# EAGLE design HSBASIC (EAGLE 9.5.0)
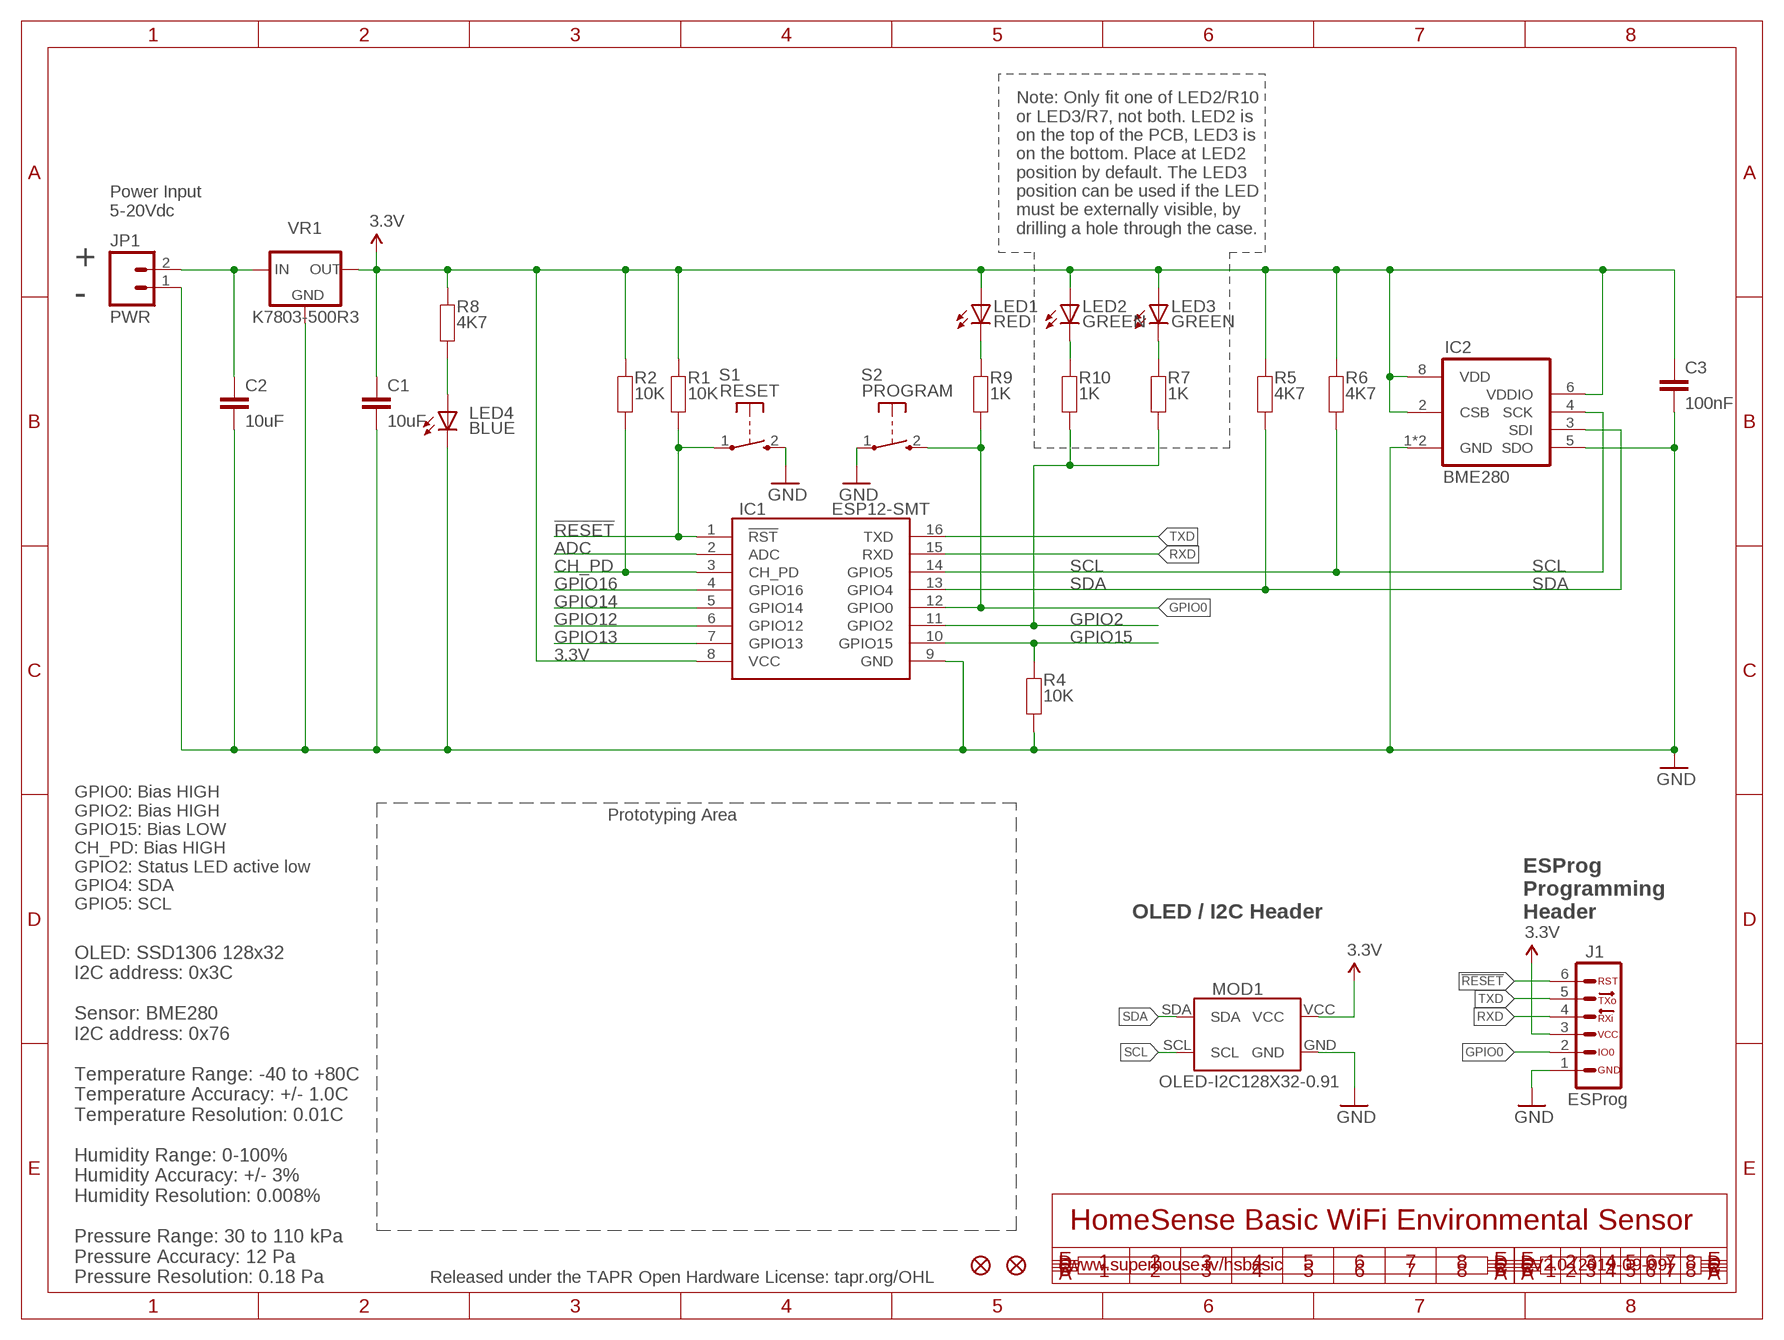
[diagram p0: schematic, sheet 1]

## Parts
C1  10uF  CAP0805  [C0805]
C2  10uF  CAP0805  [C0805]
C3  100nF  CAP0603  [C0603]
FID2  FIDUCIAL1X2.5  [FIDUCIAL-1X2.5]
FID3  FIDUCIAL1X2.5  [FIDUCIAL-1X2.5]
IC1  ESP12-SMT  [ESP12]
IC2  BME280  [BME280]
J1  ESPROG-SOCKET  [ESPROG-S]
JP1  PWR  M02PTH  [1X02]
LED1  RED  LED0603  [LED-0603]
LED2  GREEN  LED0603  [LED-0603]
LED3  GREEN  LED0603  [LED-0603]
LED4  BLUE  LED0603  [LED-0603]
MOD1  OLED-I2C128X32-0.91  [OLED-128X32-0.91]
R1  10K  RESISTOR0603  [R0603]
R2  10K  RESISTOR0603  [R0603]
R4  10K  RESISTOR0603  [R0603]
R5  4K7  RESISTOR0603  [R0603]
R6  4K7  RESISTOR0603  [R0603]
R7  1K  RESISTOR0603  [R0603]
R8  4K7  RESISTOR0603  [R0603]
R9  1K  RESISTOR0603  [R0603]
R10  1K  RESISTOR0603  [R0603]
S1  RESET  TAC_SWITCH_2PINSMT  [TACTILE_SMT_3X4X2]
S2  PROGRAM  TAC_SWITCH_2PINSMT  [TACTILE_SMT_3X4X2]
VR1  K7803-500R3  K78XX-500R3-FLAT  [K78XX-500R3-FLAT]

## Nets
3.3V: C1.1 C3.1 IC1.8(VCC) IC2.2(CSB) IC2.6(VDDIO) IC2.8(VDD) J1.3 LED1.A LED2.A LED3.A MOD1.VCC R1.2 R2.2 R5.2 R6.2 R8.2 VR1.3(OUT)
!RESET: IC1.1(!RST) J1.6 R1.1 S1.1(P)
ADC: IC1.2(ADC)
CH_PD: IC1.3(CH_PD) R2.1
GND: C1.2 C2.2 C3.2 IC1.9(GND) IC2.1(GND) IC2.5(SDO) IC2.7(GND) J1.1 JP1.1 LED4.C MOD1.GND R4.1 S1.2(S) S2.1(P) VR1.2(GND)
GPIO0: IC1.12(GPIO0) J1.2 R9.1 S2.2(S)
GPIO2: IC1.11(GPIO2) R7.1 R10.1
GPIO12: IC1.6(GPIO12)
GPIO13: IC1.7(GPIO13)
GPIO14: IC1.5(GPIO14)
GPIO15: IC1.10(GPIO15) R4.2
GPIO16: IC1.4(GPIO16)
N$1: C2.1 JP1.2 VR1.1(IN)
N$2: LED4.A R8.1
N$3: LED1.C R9.2
N$4: LED3.C R7.2
N$5: LED2.C R10.2
RXD: IC1.15(RXD) J1.4
SCL: IC1.14(GPIO5) IC2.4(SCK) MOD1.SCL R6.1
SDA: IC1.13(GPIO4) IC2.3(SDI) MOD1.SDA R5.1
TXD: IC1.16(TXD) J1.5

## Notes on the sheet
- Power Input
  5-20Vdc
- Note: Only fit one of LED2/R10
  or LED3/R7, not both. LED2 is
  on the top of the PCB, LED3 is
  on the bottom. Place at LED2
  position by default. The LED3
  position can be used if the LED
  must be externally visible, by
  drilling a hole through the case.
- +
- -
- Prototyping Area
- GPIO0: Bias HIGH
  GPIO2: Bias HIGH
  GPIO15: Bias LOW
  CH_PD: Bias HIGH
  GPIO2: Status LED active low
  GPIO4: SDA
  GPIO5: SCL
- OLED / I2C Header
- ESProg
  Programming
  Header
- HomeSense Basic WiFi Environmental Sensor
- www.superhouse.tv/hsbasic | V2.0 (2019-09-09)
- OLED: SSD1306 128x32
  I2C address: 0x3C
  
  Sensor: BME280
  I2C address: 0x76
  
  Temperature Range: -40 to +80C
  Temperature Accuracy: +/- 1.0C
  Temperature Resolution: 0.01C
  
  Humidity Range: 0-100%
  Humidity Accuracy: +/- 3%
  Humidity Resolution: 0.008%
  
  Pressure Range: 30 to 110 kPa
  Pressure Accuracy: 12 Pa
  Pressure Resolution: 0.18 Pa
- Released under the TAPR Open Hardware License: tapr.org/OHL

## Library data of the parts
C1-C3 = SuperHouse-DiscreteSemi:CAP: Capacitor Standard ceramic capacitor
FID2 FID3 = SuperHouse-Symbols:FIDUCIAL: Fiducial Alignment Points Various fiducial points for machine vision alignment.
IC1 = SuperHouse-MCUs:ESP12: ESP-12 module
IC2 = SuperHouse-Sensors:BME280: BME280 humdity, pressure, and temperature sensor
J1 = SuperHouse-Connectors:ESPROG: ESProg ESProg ESP8266 / ESP32 Programming Header
JP1 = freetronics-jon:M02: Header 2 Standard 2-pin 0.1" header. Use with straight break away headers (SKU : PRT-00116), right angle break away headers (PRT-00553), swiss pins (PRT-00743), machine pins (PRT-00117), and female headers (PRT-00115). Molex polarized connector foot print use with SKU : PRT-08233 with associated crimp pins and housings.
LED1-LED4 = SuperHouse-LEDs:LED: LEDs Standard schematic elements and footprints for 5mm, 3mm, 1206, and 0603 sized LEDs. 5mm - Spark Fun Electronics SKU : COM-00529 (and others)
MOD1 = SuperHouse-Displays:OLED-I2C: OLED module with SSD1306 I2C driver
R1 R2 R4-R10 = SuperHouse-DiscreteSemi:RESISTOR: Resistor Standard resistors.
S1 S2 = SuperHouse-Switches:TAC_SWITCH_2PIN: Momentary Tactile Switch - 2 pin Uxcell 3x4x2mm switch with 2 SMT pads
VR1 = SuperHouse-Regulators:K78XX-500R3: K78xx-500R3 switchmode voltage regulator

## Net classes
0 default: width 0.203 mm, drill 0.356 mm, clearance 0.152 mm
1 power: width 0.203 mm, clearance 0.152 mm

## Board
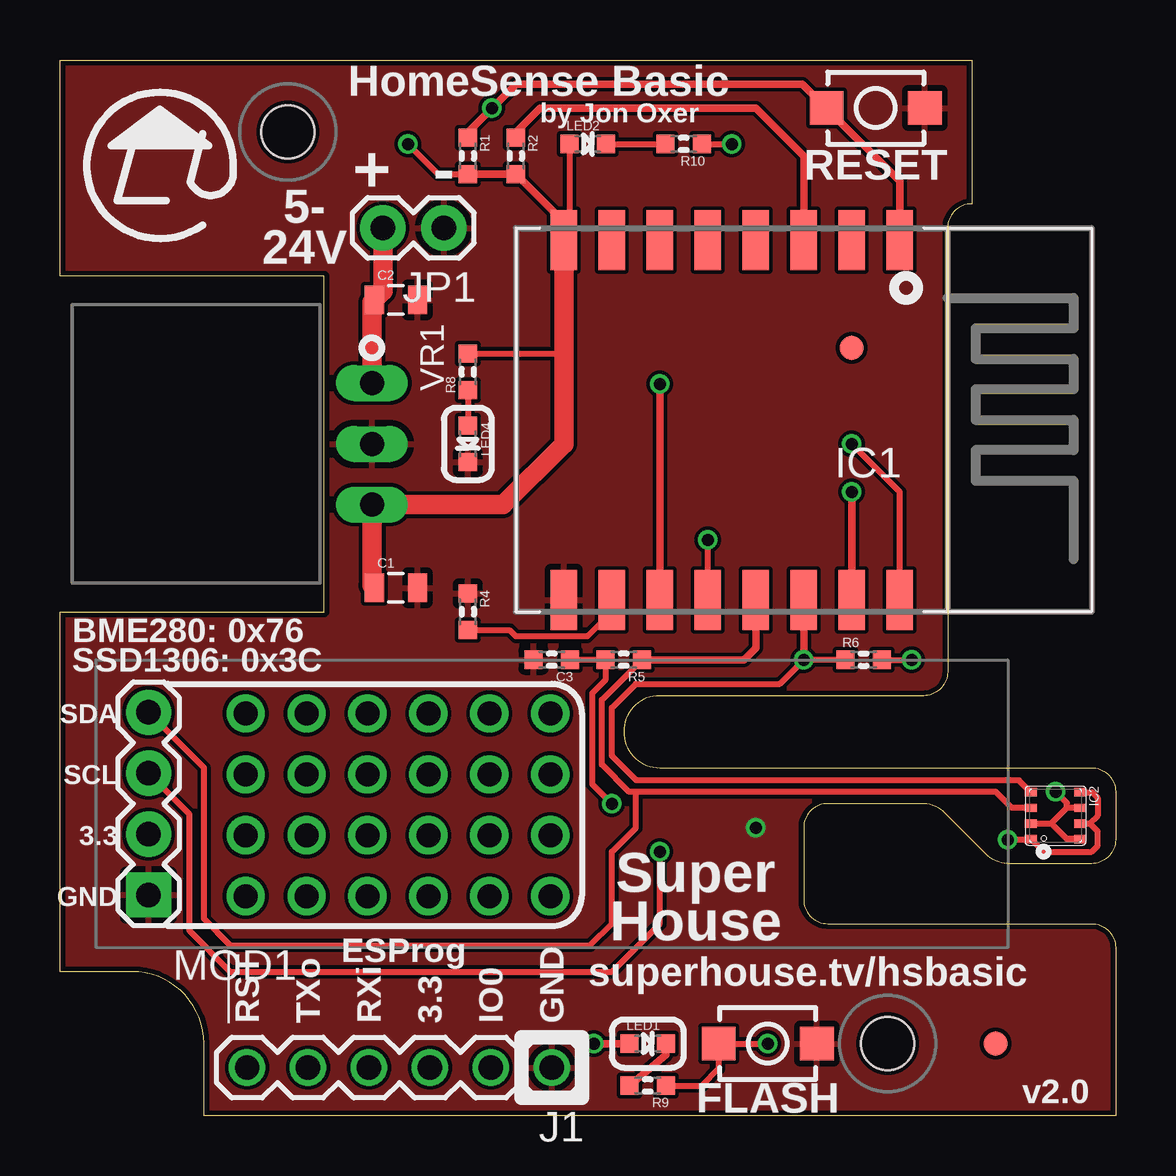
[diagram p1: board, top side]
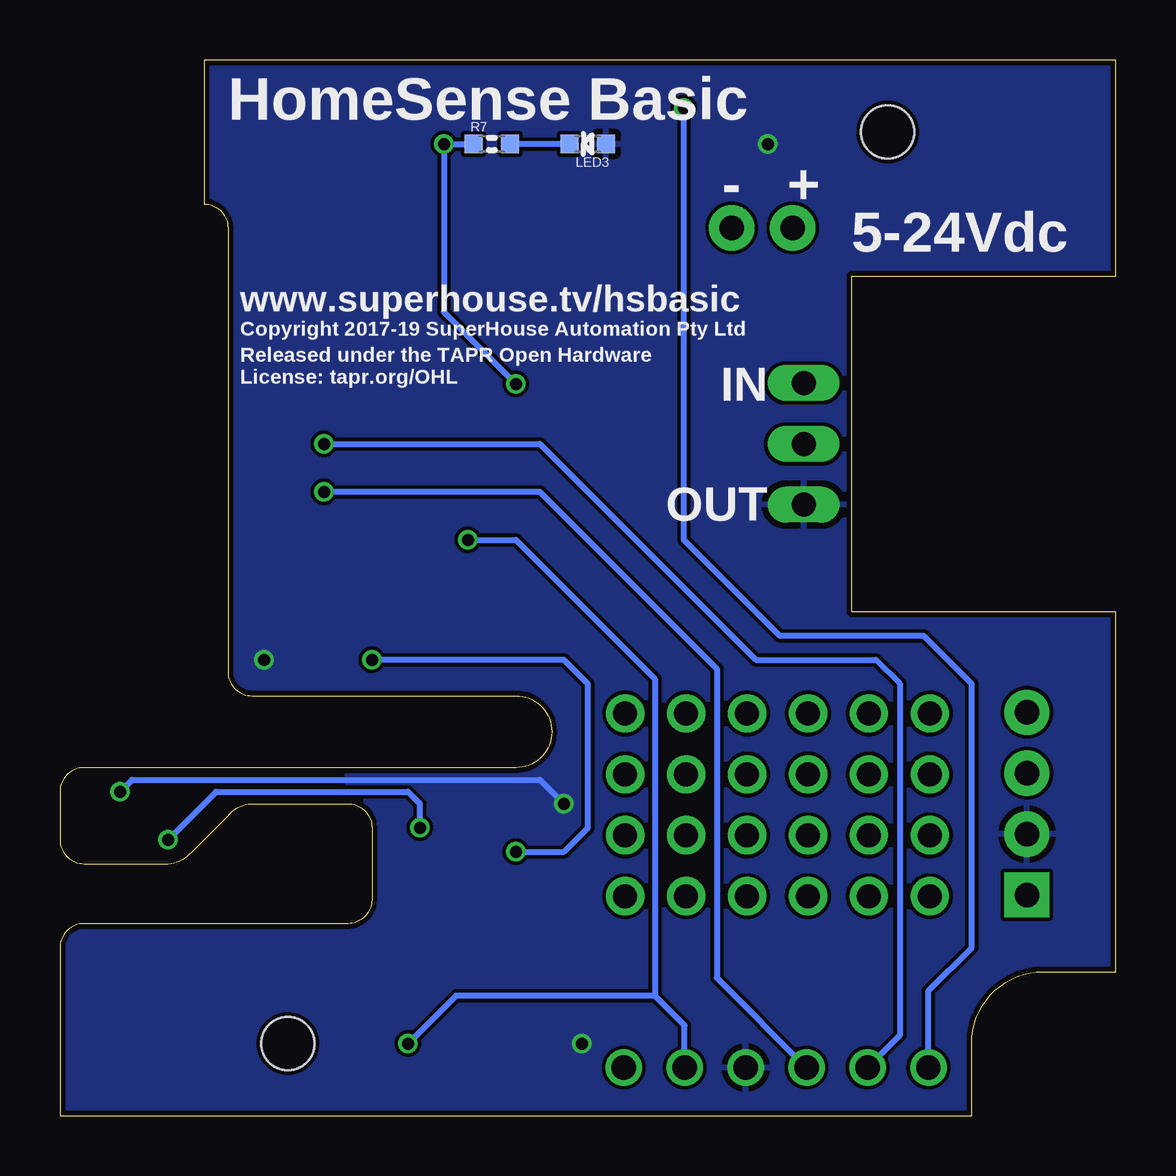
[diagram p2: board, bottom side, seen from below]

Size 44 x 44 mm. Coordinates in mm from the lower left corner, seen from the top.
Outline: 0,6 0,21 11,21 11,35 0,35 0,44 38,44 38,38 arc90 37,37 37,18.5 arc-90 36,17.5 25,17.5 arc90 23.5,16 arc90 25,14.5 43,14.5 arc-90 44,13.5 44,11.5 arc-90 43,10.5 39.5,10.5 arc-45 38.5,11 37,12.5 arc45 36,13 32,13 arc90 31,12 31,9 arc90 32,8 43,8 arc-90 44,7 44,0 6,0 6,3 arc90 3,6 0,6
Copper layers (1*16): Top 0.035mm / dielectric 1.5mm / Bottom 0.035mm
Design rules "ElectroDragon_2layer_DRU_no_angle_20140221 *": minimum track width 6mil, minimum drill 12mil, track to track 6mil, track to pad 6mil, pad to pad 6mil, via to via 6mil, smd to smd 6mil, copper to edge 8mil, drill to drill 6mil, minimum pad ring 10mil, minimum via ring 6mil, stop-mask expansion 4mil, vias tented up to drill 25mil, thermal gap 10mil
Holes 2.2 mm at 34.5,3 9.5,41

### Footprints (pad centres in the part's own frame; a part is rotated, then mirrored left to right if it is on the bottom)
C0805 = smd 0.8 x 1.2: 1 -0.9,0; 2 0.9,0
C0603 = smd 0.762 x 0.762: 1 -0.762,0; 2 0.762,0
FIDUCIAL-1X2.5 = smd 1 x 1: 1 0,0
ESP12 = smd 1.1 x 2.5: 1 -4,-7.5; 2 -2,-7.5; 3 0,-7.5; 4 2,-7.5; 5 4,-7.5; 6 6,-7.5; 7 8,-7.5; 8 10,-7.5; 9 10,7.5; 10 8,7.5; 11 6,7.5; 12 4,7.5; 13 2,7.5; 14 0,7.5; 15 -2,7.5; 16 -4,7.5
BME280 = smd 0.35 x 0.5: 1 0.975,-1.025; 2 0.325,-1.025; 3 -0.325,-1.025; 4 -0.975,-1.025; 5 -0.975,1.025; 6 -0.325,1.025; 7 0.325,1.025; 8 0.975,1.025
ESPROG-S = drill 1.016: 1 0,0; 2 2.54,0; 3 5.08,0; 4 7.62,0; 5 10.16,0; 6 12.7,0
1X02 = drill 1.016 pad 1.88: 1 0,0; 2 2.54,0
LED-0603 = smd 0.762 x 0.762: A -0.762,0; C 0.762,0
OLED-128X32-0.91 = drill 1.016 pad 1.88 square: GND -18.31,-3.81 | drill 1.016 pad 1.88: SCL -18.31,1.27; SDA -18.31,3.81; VCC -18.31,-1.27
R0603 = smd 0.762 x 0.762: 1 -0.762,0; 2 0.762,0
TACTILE_SMT_3X4X2 = smd 1.4 x 1.4: 1 -2.05,0; 2 2.05,0
K78XX-500R3-FLAT = drill 1 long: 1 -2.54,0; 2 0,0; 3 2.54,0

### Placement (x,y rotation side)
C1  14,22 0 top
C2  14,34 0 top
C3  20.5,19 180 top
FID2  39,3 0 top
FID3  33,32 0 top
IC1  31,29 180 top
IC2  41.5,12.5 270 top
J1  20.5,2 180 top
JP1  16,37 180 top
LED1  24.5,3 0 top
LED2  22,40.5 0 top
LED3  22,40.5 180 bottom
LED4  17,28 270 top
MOD1  22,13 0 top
R1  17,40 270 top
R2  19,40 270 top
R4  17,21 270 top
R5  23.5,19 180 top
R6  33.5,19 0 top
R7  26,40.5 0 bottom
R8  17,31 90 top
R9  24.5,1.25 180 top
R10  26,40.5 180 top
S1  34,42 0 top
S2  29.5,3 180 top
VR1  13,28 270 top

### Tracks (layer width: path | path; a pad name or v marks a point on that pad's centre or on a via)
3.3V  (via drill 0.5)
  Top 0.254: 21,37.24 IC1.8 21.24,36.74 LED3.A | v14.5,40.5 15.76,39.24 R1.2 | IC2.8 41.98,11.53 41.33,12.18 | IC2.2 41.33,12.18 | IC2.6 41.98,12.82 | 41.33,12.18 41.98,12.82 | 41.98,12.82 41.98,13.03 v41.5,13.5 | R6.2 v35.5,19 | C3.1 R5.2 22.74,18.15 22.19,17.6 22.19,13.81 v23,13 | R8.2 20.74,31.76 21,31.5
  Top 0.305: R1.2 R2.2 21,37.24 | LED1.A v22.25,3
  Top 0.813: IC1.8 21,31.5 21,28 18.46,25.46 VR1.3 13,22.1 C1.1
  Bottom 0.254: v41.5,13.5 41,14 24,14 v23,13
  pour Bottom: 38,44 0,44 0,35 11,35 11,21 0,21 0,6 3,6 arc-90 6,3 6,0 44,0 44,8 32,8 32,14.5 25,14.5 arc-90 23.5,16 arc-90 25,17.5 36,17.5 arc90 37,18.5 37,37 arc-90 38,38
!RESET  (via drill 0.5)
  Top 0.305: IC1.1 35,38.95 S1.1 30.95,43 19,43 v18,42 17,41 R1.1
  Bottom 0.254: v18,42 18,24 14,20 8,20 6,18 6,7 7.8,5.2 J1.6
CH_PD
  Top 0.254: 19,41 R2.1
  Top 0.305: IC1.3 31,40 29,42 20,42 19,41
GND  (via drill 0.5)
  Top 0.254: IC2.7 42.92,12.18 | 42.92,12.18 43.25,12.5 43.25,13.25 43.02,13.47 IC2.5 | 42.92,12.18 43.25,11.85 43.25,11.25 43,11 41,11 IC2.1 40.45,11.5 v39.5,11.5
  Bottom 0.254: v39.5,11.5 37.5,13.5 29.5,13.5 29,13 v29,12
  pour Top: 0,6 3,6 arc-90 6,3 6,0 44,0 44,8 32,8 32,14.5 25,14.5 arc-90 23.5,16 arc-90 25,17.5 36,17.5 arc90 37,18.5 37,37 arc-90 38,38 38,44 0,44 0,35 11,35 11,21 0,21
GPIO0  (via drill 0.5)
  Top 0.254: R9.1 26.76,1.25 27.45,1.94 S2.2 v29.5,3 | IC1.12 v27,24
  Bottom 0.254: 19.2,5 27.5,5 v29.5,3 | v27,24 25,24 19.2,18.2 19.2,5 | J1.2 17.96,3.76 19.2,5
GPIO2  (via drill 0.5)
  Top 0.254: R7.1 v28,40.5
  Top 0.305: v25,30.5 IC1.11
  Bottom 0.254: R7.1 v28,40.5 28,33.5 v25,30.5
GPIO15
  Top 0.254: IC1.10 23,21 21.97,19.97 19,19.97 18.73,20.24 R4.2
N$1
  Top 0.813: VR1.1 13,33.9 C2.1 13.46,34.36 JP1.2
N$2
  Top 0.254: R8.1 LED4.A
N$3
  Top 0.305: LED1.C 25.26,2.52 R9.2
N$4
  Bottom 0.254: LED3.C R7.2
N$5
  Top 0.254: LED2.C R10.2
N$14  (via drill 1 pad 1.6)
  other vias: 7.74,16.76
N$15  (via drill 1 pad 1.6)
  other vias: 7.74,14.22
N$16  (via drill 1 pad 1.6)
  other vias: 7.74,11.68
N$17  (via drill 1 pad 1.6)
  other vias: 7.74,9.14
N$18  (via drill 1 pad 1.6)
  other vias: 10.28,9.14
N$19  (via drill 1 pad 1.6)
  other vias: 10.28,11.68
N$20  (via drill 1 pad 1.6)
  other vias: 10.28,14.22
N$21  (via drill 1 pad 1.6)
  other vias: 10.28,16.76
N$22  (via drill 1 pad 1.6)
  other vias: 12.82,16.76
N$23  (via drill 1 pad 1.6)
  other vias: 12.82,14.22
N$24  (via drill 1 pad 1.6)
  other vias: 12.82,11.68
N$26  (via drill 1 pad 1.6)
  other vias: 12.82,9.14
N$27  (via drill 1 pad 1.6)
  other vias: 15.36,9.14
N$28  (via drill 1 pad 1.6)
  other vias: 17.9,9.14
N$29  (via drill 1 pad 1.6)
  other vias: 17.9,11.68
N$30  (via drill 1 pad 1.6)
  other vias: 15.36,11.68
N$31  (via drill 1 pad 1.6)
  other vias: 15.36,14.22
N$32  (via drill 1 pad 1.6)
  other vias: 17.9,14.22
N$33  (via drill 1 pad 1.6)
  other vias: 17.9,16.76
N$34  (via drill 1 pad 1.6)
  other vias: 15.36,16.76
N$35  (via drill 1 pad 1.6)
  other vias: 20.44,9.14
N$36  (via drill 1 pad 1.6)
  other vias: 20.44,11.68
N$37  (via drill 1 pad 1.6)
  other vias: 20.44,14.22
N$38  (via drill 1 pad 1.6)
  other vias: 20.44,16.76
RXD  (via drill 0.5)
  Top 0.305: v33,26 IC1.15
  Bottom 0.254: v33,26 24,26 18,20 16.62,18.62 16.62,5.74 J1.4
SCL  (via drill 0.5)
  Top 0.254: IC2.4 39.98,13.97 24.02,13.97 23,15 23,17 24,18 30,18 v31,19 R6.1 | v25,11 25,8 23,6 7.1,6 5.4,7.7 5.4,12.06 5.4,12.56 MOD1.SCL
  Top 0.305: v31,19 IC1.14
  Bottom 0.254: v25,11 23,11 22,12 22,18 23,19 v31,19
SDA
  Top 0.254: IC2.3 39.67,12.82 39,13.5 23.93,13.5 | 23.93,13.5 23.73,13.5 22.59,14.63 22.59,17.33 R5.1 | 23.93,13.5 24,13.43 24,12 23,11 23,8 22.1,7.1 7.1,7.1 6,8.2 6,13.5 6,14.5 MOD1.SDA
  Top 0.305: IC1.13 29,19.5 28.5,19 R5.1
TXD  (via drill 0.5)
  Top 0.254: IC1.16 35,26 v33,28
  Bottom 0.254: v33,28 24,28 16,20 15,19 9.99,19 9,18.01 9,3.34 J1.5

### Text on the board
tPlace: HomeSense Basic | by Jon Oxer | RESET | + | - | 5- / 24V | BME280: 0x76 / SSD1306: 0x3C | SDA | SCL | 3.3 | GND | ESProg | Super / House | superhouse.tv/hsbasic | !RST | TXo | RXi | 3.3 | IO0 | GND | FLASH | v2.0
bPlace: HomeSense Basic | + | - | 5-24Vdc | www.superhouse.tv/hsbasic | Copyright 2017-19 SuperHouse Automation Pty Ltd | IN | Released under the TAPR Open Hardware / License: tapr.org/OHL | OUT